# EAGLE schematic voltage_doubler (EAGLE 6.4)
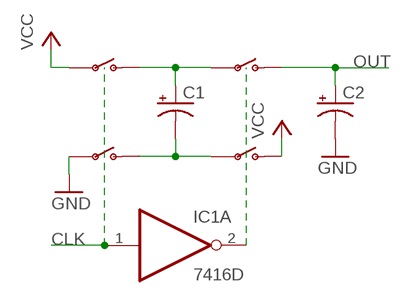
[diagram p0: schematic, sheet 1]

## Parts
C1  CAP_POL1206  [EIA3216]
C2  CAP_POL1206  [EIA3216]
IC1  7416D  [SO14]
U$1  SWITCH-SPST-2RA  [R_SW_TH]
U$2  SWITCH-SPST-2RA  [R_SW_TH]
U$3  SWITCH-SPST-2RA  [R_SW_TH]
U$4  SWITCH-SPST-2RA  [R_SW_TH]

## Nets
CLK: IC1.1(A:I)
GND: C2.C(-) U$3.P$4(P)
N$1: IC1.2(A:O)
N$5: C1.C(-) U$3.P$3(O) U$4.P$4(P)
N$6: C1.A(+) U$1.P$3(O) U$2.P$4(P)
OUT: C2.A(+) U$2.P$3(O)
VCC: U$1.P$4(P) U$4.P$3(O)
Unconnected: IC1.3(B:I) IC1.4(B:O) IC1.5(C:I) IC1.6(C:O) IC1.8(D:O) IC1.9(D:I) IC1.10(E:O) IC1.11(E:I) IC1.12(F:O) IC1.13(F:I)

## Power pins joined to a net without a drawn wire
GND: IC1.7(P:GND)
VCC: IC1.14(P:VCC)

## Library data of the parts
C1 C2 = SparkFun-Passives:CAP_POL: Capacitor Polarized These are standard SMD and PTH capacitors. Normally 10uF, 47uF, and 100uF in electrolytic and tantalum varieties. Always verify the external diameter of the through hole cap, it varies with capacity, voltage, and manufacturer. The EIA devices should be standard.
IC1 = 74xx-us:74*16: Hex INVERTER, open collector, high-voltage
U$1-U$4 = SparkFun-Electromechanical:SWITCH-SPST-2